# Altium schematic sheet bat_connectors.SchDoc
size A3; SheetNumber: 14; SheetTotal: 15; SheetDescription: Sense Connectors
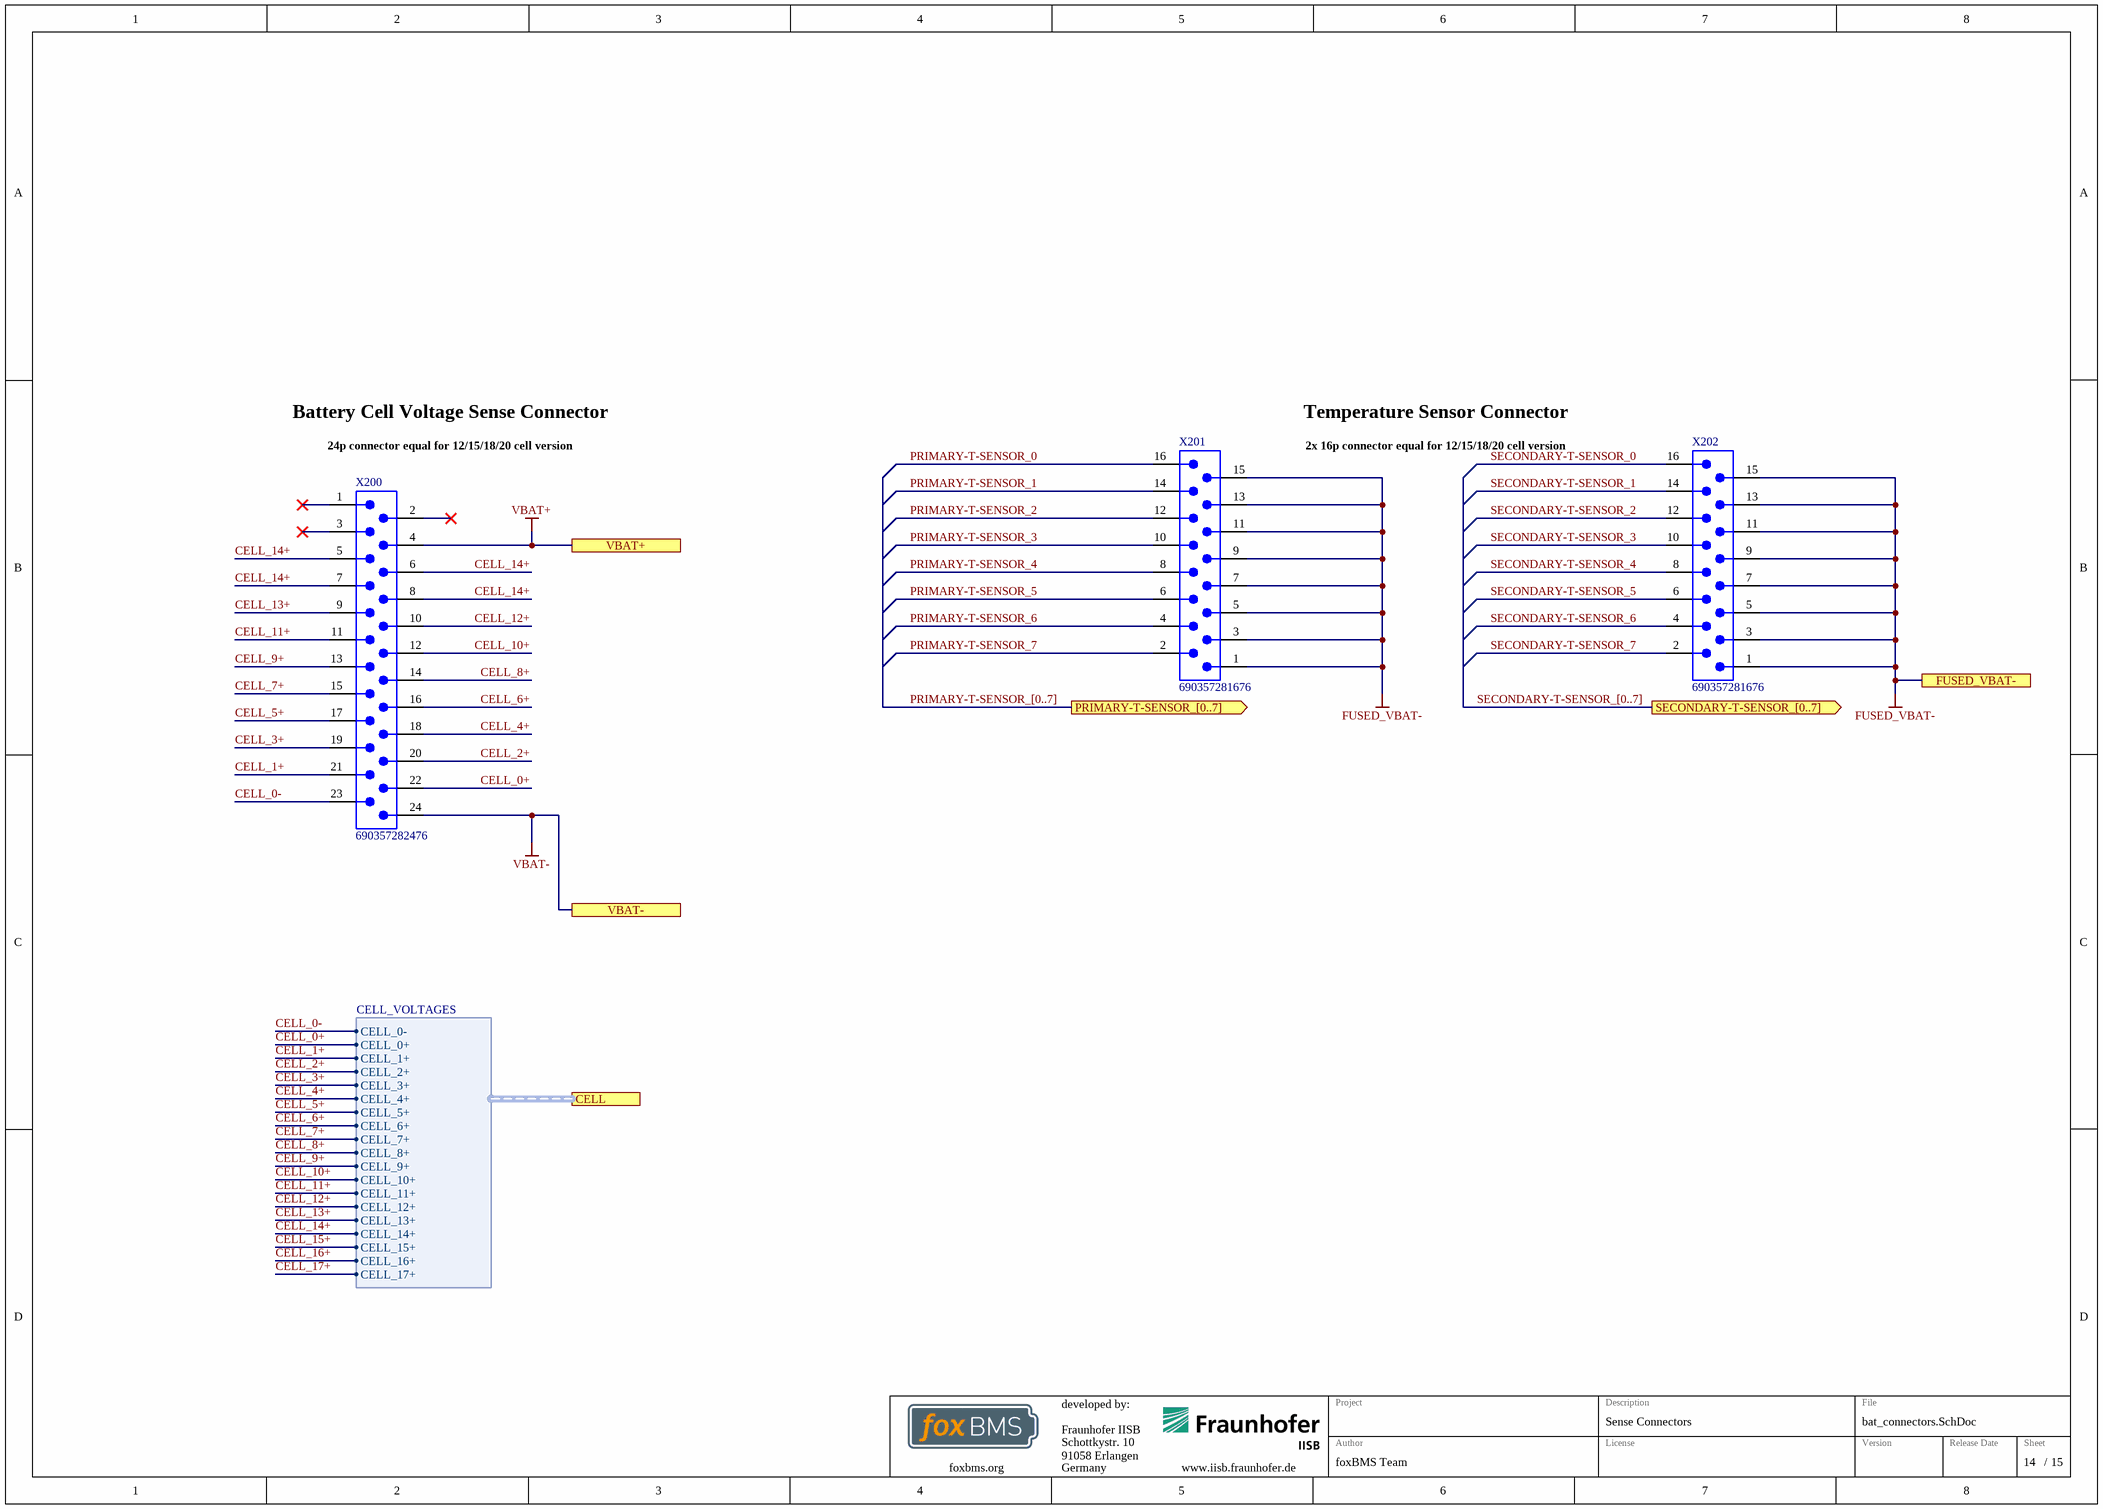
[diagram p0: bat_connectors.SchDoc]

## Parts
X200  690357282476  [690357282476]
X201  690357281676  [690357281676]
X202  690357281676  [690357281676]

## Ports
CELL (harness CELL_VOLTAGES), FUSED_VBAT-, PRIMARY-T-SENSOR_[0..7] (out), SECONDARY-T-SENSOR_[0..7] (out), VBAT+, VBAT-

## Harnesses
CELL_VOLTAGES: CELL_0-, CELL_0+, CELL_1+, CELL_2+, CELL_3+, CELL_4+, CELL_5+, CELL_6+, CELL_7+, CELL_8+, CELL_9+, CELL_10+, CELL_11+, CELL_12+, CELL_13+, CELL_14+, CELL_15+, CELL_16+, CELL_17+

## Nets
FUSED_VBAT-: X201.1 X201.3 X201.5 X201.7 X201.9 X201.11 X201.13 X201.15 X202.1 X202.3 X202.5 X202.7 X202.9 X202.11 X202.13 X202.15 ; port FUSED_VBAT-
VBAT+: X200.4 ; port VBAT+
VBAT-: X200.24 ; port VBAT-
CELL_0+: X200.22 ; port CELL.CELL_0+
CELL_0-: X200.23 ; port CELL.CELL_0-
CELL_1+: X200.21 ; port CELL.CELL_1+
CELL_2+: X200.20 ; port CELL.CELL_2+
CELL_3+: X200.19 ; port CELL.CELL_3+
CELL_4+: X200.18 ; port CELL.CELL_4+
CELL_5+: X200.17 ; port CELL.CELL_5+
CELL_6+: X200.16 ; port CELL.CELL_6+
CELL_7+: X200.15 ; port CELL.CELL_7+
CELL_8+: X200.14 ; port CELL.CELL_8+
CELL_9+: X200.13 ; port CELL.CELL_9+
CELL_10+: X200.12 ; port CELL.CELL_10+
CELL_11+: X200.11 ; port CELL.CELL_11+
CELL_12+: X200.10 ; port CELL.CELL_12+
CELL_13+: X200.9 ; port CELL.CELL_13+
CELL_14+: X200.5 X200.6 X200.7 X200.8 ; port CELL.CELL_14+
CELL_15+: port CELL.CELL_15+
CELL_16+: port CELL.CELL_16+
CELL_17+: port CELL.CELL_17+
PRIMARY-T-SENSOR_0: X201.16
PRIMARY-T-SENSOR_1: X201.14
PRIMARY-T-SENSOR_2: X201.12
PRIMARY-T-SENSOR_3: X201.10
PRIMARY-T-SENSOR_4: X201.8
PRIMARY-T-SENSOR_5: X201.6
PRIMARY-T-SENSOR_6: X201.4
PRIMARY-T-SENSOR_7: X201.2
SECONDARY-T-SENSOR_0: X202.16
SECONDARY-T-SENSOR_1: X202.14
SECONDARY-T-SENSOR_2: X202.12
SECONDARY-T-SENSOR_3: X202.10
SECONDARY-T-SENSOR_4: X202.8
SECONDARY-T-SENSOR_5: X202.6
SECONDARY-T-SENSOR_6: X202.4
SECONDARY-T-SENSOR_7: X202.2

Not connected (* = marked no-connect by the designer): X200 1* 2* 3*

## Buses and harness runs
bus PRIMARY-T-SENSOR_[0..7] = port PRIMARY-T-SENSOR_[0..7]
bus SECONDARY-T-SENSOR_[0..7] = port SECONDARY-T-SENSOR_[0..7]

## Notes on the sheet
- Battery Cell Voltage Sense Connector
- 24p connector equal for 12/15/18/20 cell version
- Temperature Sensor Connector
- 2x 16p connector equal for 12/15/18/20 cell version
- Fraunhofer IISB
- Schottkystr. 10
- developed by:
- 91058 Erlangen
- Germany
- Author
- Project
- License
- Description
- File
- Version
- Release Date
- Sheet
- foxbms.org <https://foxbms.org>
- www.iisb.fraunhofer.de <https://www.iisb.fraunhofer.de/>
- foxBMS Team
- /

## Library data of the parts
X200 = CMP-1502-00899-2: NexarPartId: 65759601; Gender: Male; Operating Supply Voltage: 100V; Current Rating: 1.5A; Insulation Resistance: 1GΩ; Contact Resistance: 10mΩ; Pitch: 2.54mm; Max Operating Temperature: 105°C; RoHS: Compliant; Lead Pitch: 2.54mm; Packaging: Tape and Reel; Number of Pins: 24; Length: 31.31mm; Min Operating Temperature: -40°C
X201 X202 = CMP-1502-00895-2: NexarPartId: 65759598; Operating Supply Voltage: 100V; Gender: Male; Pitch: 2.54mm; Insulation Resistance: 1GΩ; Contact Resistance: 10mΩ; Current Rating: 1.5A; RoHS: Compliant; Min Operating Temperature: -40°C; Packaging: Tape and Reel; Lead Pitch: 2.54mm; Number of Pins: 16; Max Operating Temperature: 105°C; Length: 21.15mm